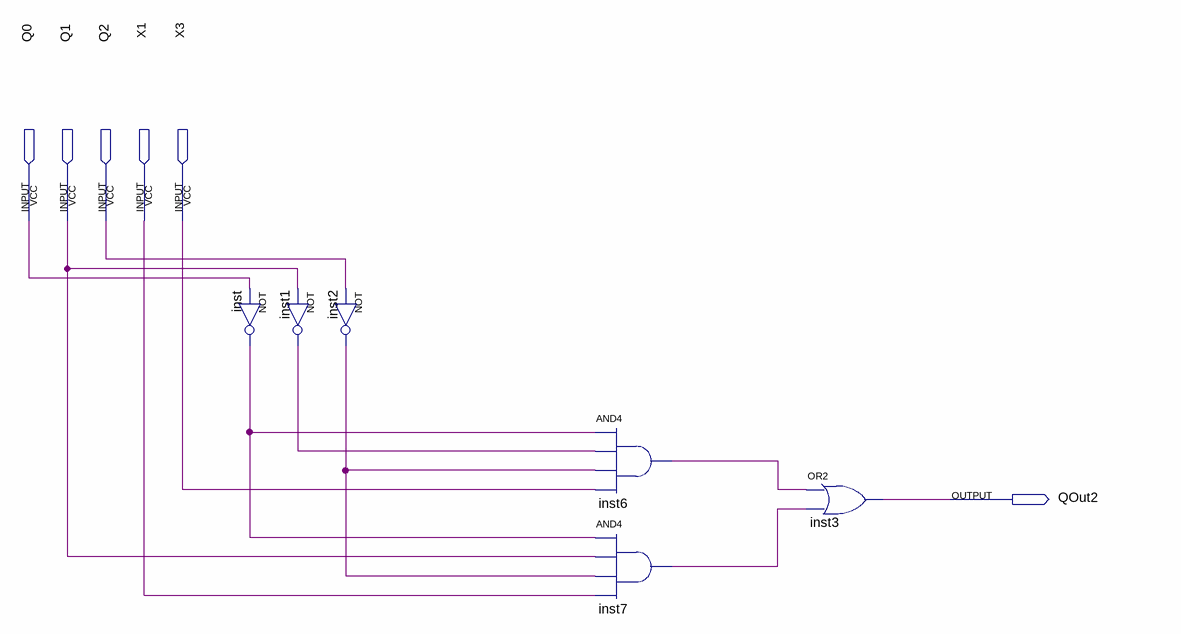
[diagram p0: schematic sheet]
// Quartus schematic M_q2.bdf as structural Verilog: 6 symbols, 6 pins
module M_q2 (
  input  Q0,
  input  Q1,
  input  Q2,
  input  X1,
  input  X3,
  output QOut2
);

  wire inst1_out, inst2_out, inst6_out, inst7_out, inst_out;

  not inst (inst_out, Q0);
  not inst1 (inst1_out, Q1);
  not inst2 (inst2_out, Q2);
  and inst6 (inst6_out, inst_out, inst1_out, inst2_out, X3);
  and inst7 (inst7_out, inst_out, Q1, inst2_out, X1);
  or inst3 (QOut2, inst6_out, inst7_out);
endmodule
